# Altium schematic sheet measurements.SchDoc
size A4; Date: 04.12.2023; ApprovedBy: Cezary Worek; Author: Mikołaj Pichita; CompanyName: AGH University of Science and Technology; SheetNumber: 12; SheetTotal: 16
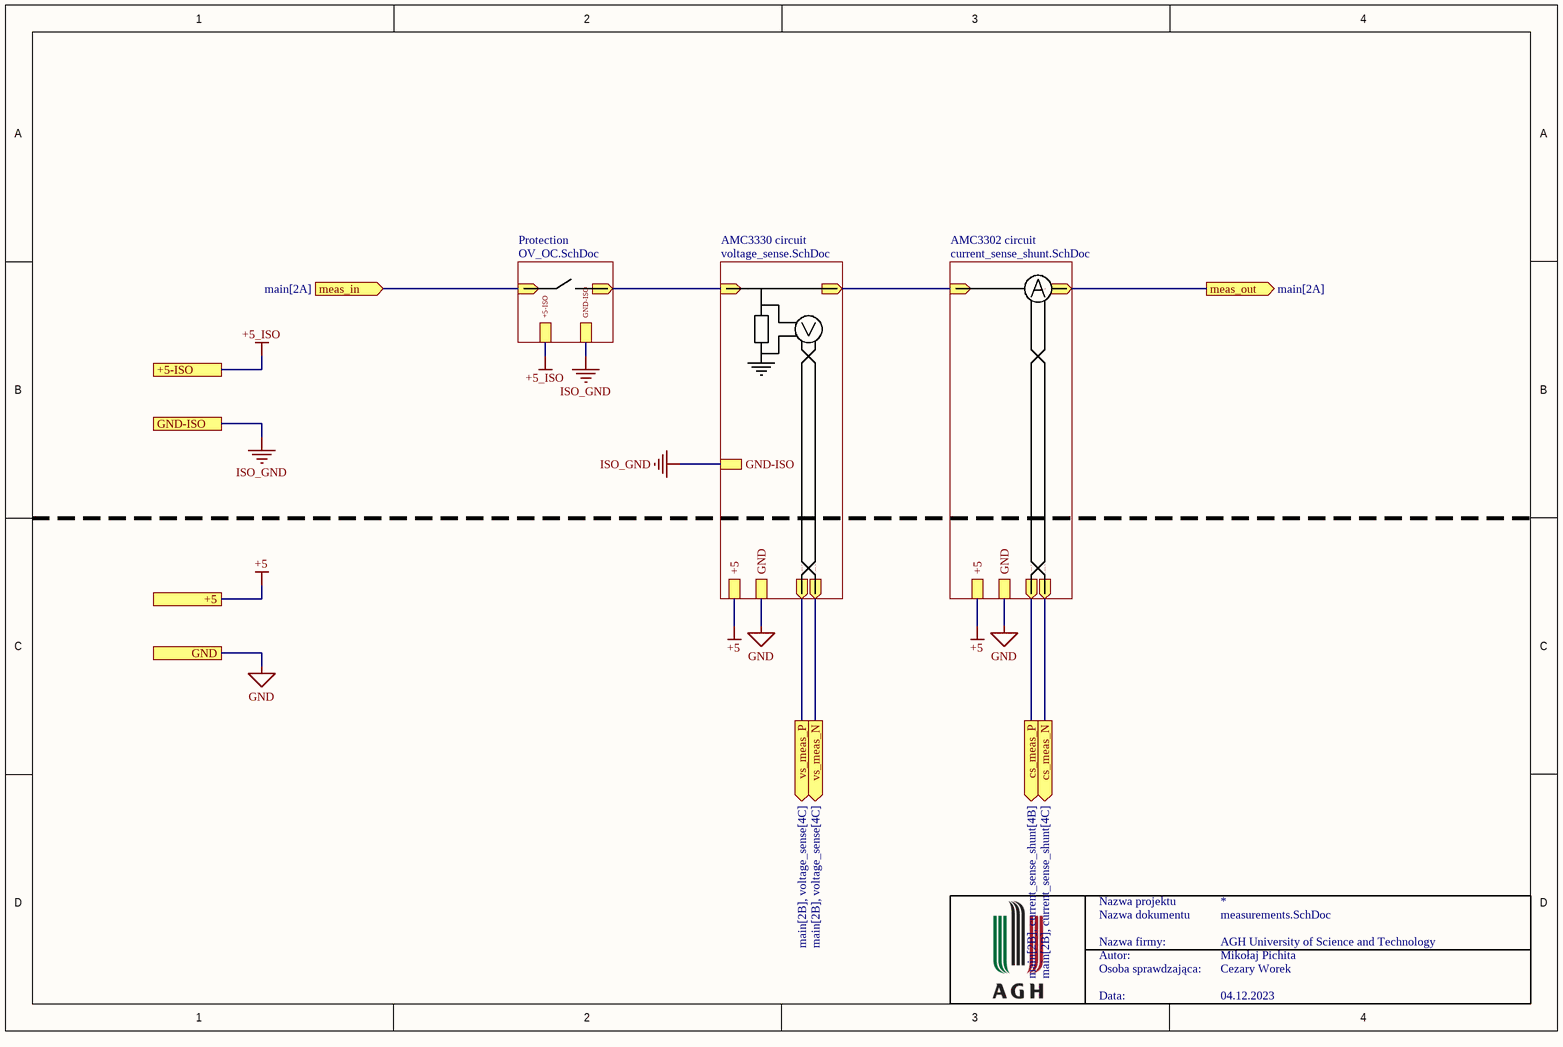
[diagram p0: measurements.SchDoc]

## Sub-sheets
AMC3302 circuit = current_sense_shunt.SchDoc: cs_in (in), cs_out (out), cs_meas_P (out), cs_meas_N (out), +5, GND
AMC3330 circuit = voltage_sense.SchDoc: vs_in (in), vs_out (out), vs_meas_P (out), vs_meas_N (out), +5, GND, GND-ISO
Protection = OV_OC.SchDoc: In (in), Out (out), +5-ISO, GND-ISO

## Ports
+5 (see main[2B], choke_current_meas[4B], current_sense_shunt[4A], full_bridge[1C], isolator[1B], microcontroller[1C], power_supply[2B], voltage_sense[4A]), +5-ISO (see main[2A], full_bridge[1B], isolator[4B], OV_OC[1B], power_supply[3B], testpoint[2A]), cs_meas_N (out, see main[2B], current_sense_shunt[4C]), cs_meas_P (out, see main[2B], current_sense_shunt[4B]), GND (see main[2B], choke_current_meas[4B], current_sense_shunt[4B], full_bridge[1D], isolator[1B], microcontroller[1C], power_supply[1B], voltage_sense[4B]), GND-ISO (see main[2A], full_bridge[1B], input_filter[2C], isolator[4B], output_filter[1B], OV_OC[1B], power_supply[3B], testpoint[2A], voltage_sense[1B]), meas_in (in, see main[2A]), meas_out (out, see main[2A]), vs_meas_N (out, see main[2B], voltage_sense[4C]), vs_meas_P (out, see main[2B], voltage_sense[4C])

## Nets
+5: port +5, sheet AMC3302 circuit/+5, sheet AMC3330 circuit/+5
+5_ISO: port +5-ISO, sheet Protection/+5-ISO
GND: port GND, sheet AMC3302 circuit/GND, sheet AMC3330 circuit/GND
ISO_GND: port GND-ISO, sheet AMC3330 circuit/GND-ISO, sheet Protection/GND-ISO
cs_meas_N: port cs_meas_N, sheet AMC3302 circuit/cs_meas_N
cs_meas_P: port cs_meas_P, sheet AMC3302 circuit/cs_meas_P
meas_in: port meas_in, sheet Protection/In
meas_out: port meas_out, sheet AMC3302 circuit/cs_out
vs_meas_N: port vs_meas_N, sheet AMC3330 circuit/vs_meas_N
vs_meas_P: port vs_meas_P, sheet AMC3330 circuit/vs_meas_P
(unnamed): sheet AMC3302 circuit/cs_in, sheet AMC3330 circuit/vs_out
(unnamed): sheet AMC3330 circuit/vs_in, sheet Protection/Out

## Notes on the sheet
- Nazwa projektu
- Nazwa dokumentu
- Nazwa firmy:
- Autor:
- Osoba sprawdzająca:
- Data: